# EasyEDA schematic AUGIS_Voltage_Regulator_Board.json
TITLE: AUGIS_Voltage_Regulator_Board; REV: 1.0; Date: 2021-03-09; Sheet: 1/1; Company: BFH
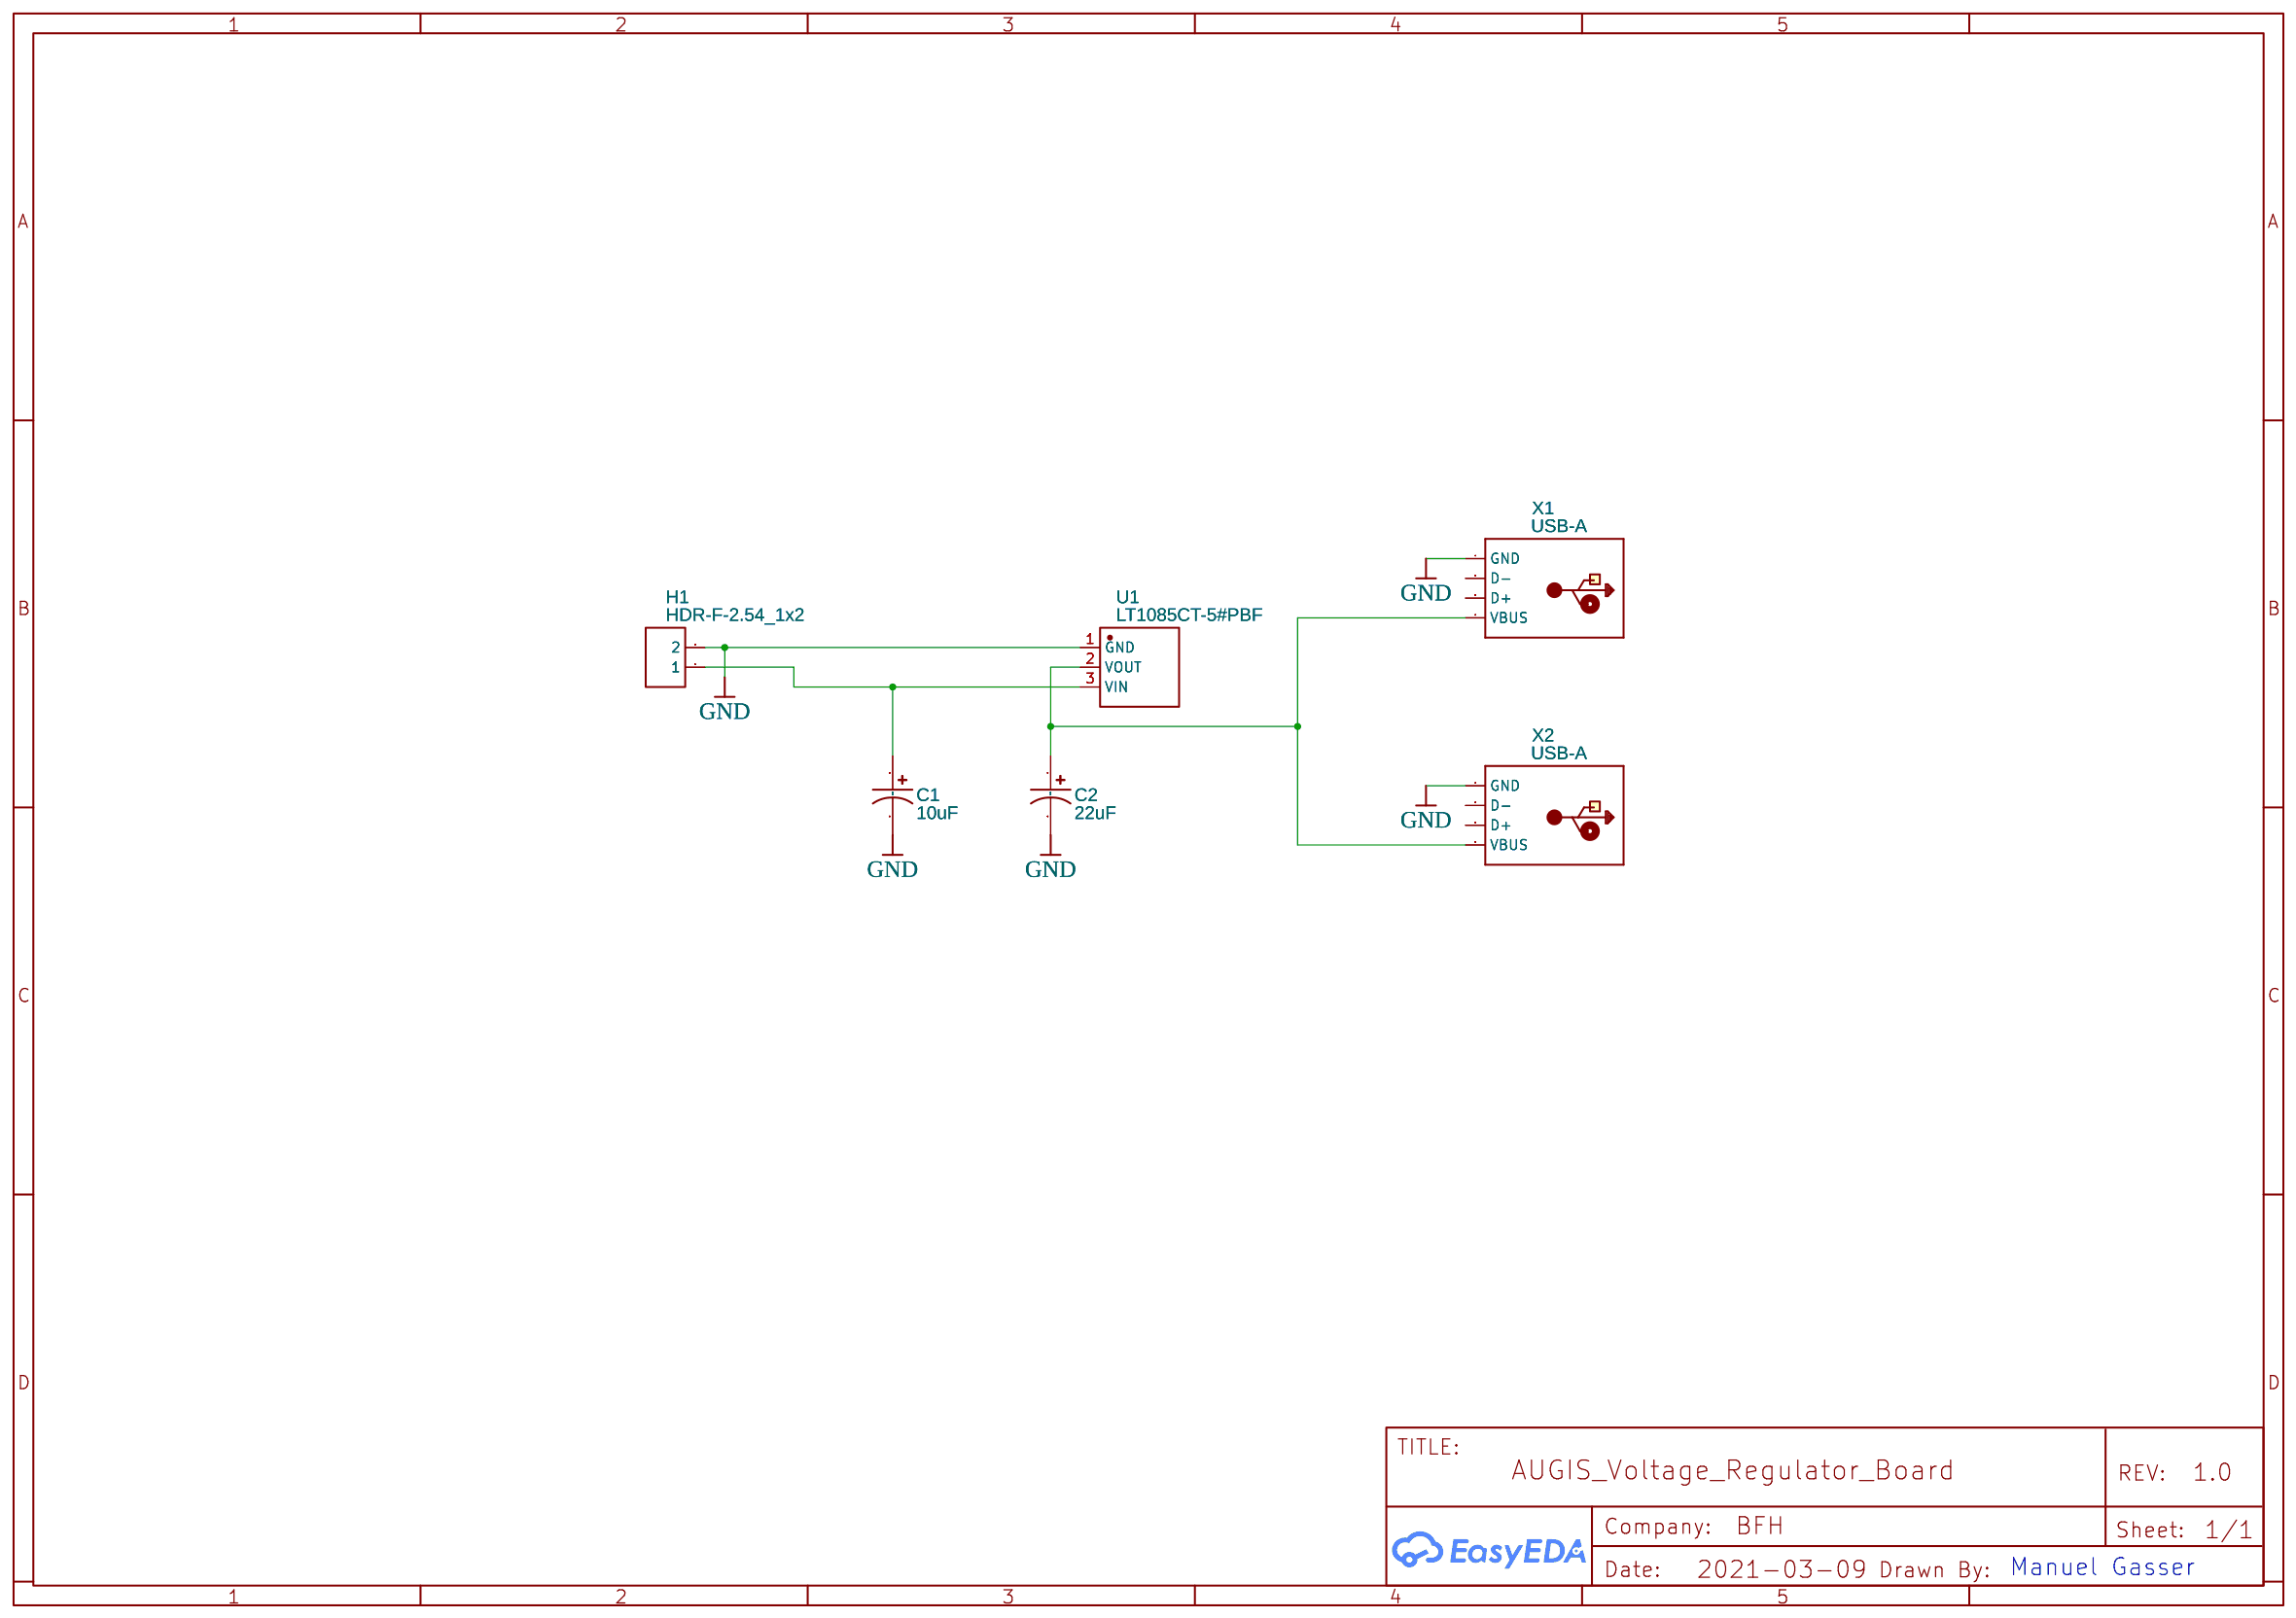
[diagram p0: schematic sheet]

## Parts
C1  10uF  [CASE-A_3216]
C2  22uF  [CASE-A_3216]
H1  HDR-F-2.54_1x2  [HDR-F-2.54_1X2]
U1  LT1085CT-5#PBF  [TO-220-3_L10.0-W4.5-P2.54-L]
X1  USB-A  [MOLEX_480371000]
X2  USB-A  [MOLEX_480371000]

## Library data of the parts
C1 C2 = C_Tan_SMD_A_US: Contributor: LCEDA_Lib
H1 = HDR-F-2.54_1x2: Supplier Part: C49661; Supplier: LCSC; Contributor: LCEDA_Lib
U1 = LT1085CT-5#PBF: Supplier: LCSC; Supplier Part: C661212; Manufacturer: Analog Devices; Contributor: LCSC
X1 X2 = USB-A: Contributor: Adafruit

## Nets
GND: C1.2 C2.2 H1.2 U1.1(GND) X1.4(GND) X2.4(GND)
Net-(C1-1): C1.1 H1.1 U1.3(VIN)
Net-(C2-1): C2.1 U1.2(VOUT) X1.1(VBUS) X2.1(VBUS)

Not connected (* = marked no-connect by the designer): X1 2(D-) 3(D+); X2 2(D-) 3(D+)

## Notes on the sheet
- Manuel Gasser
